# EAGLE design bicore (EAGLE 9.0.0)
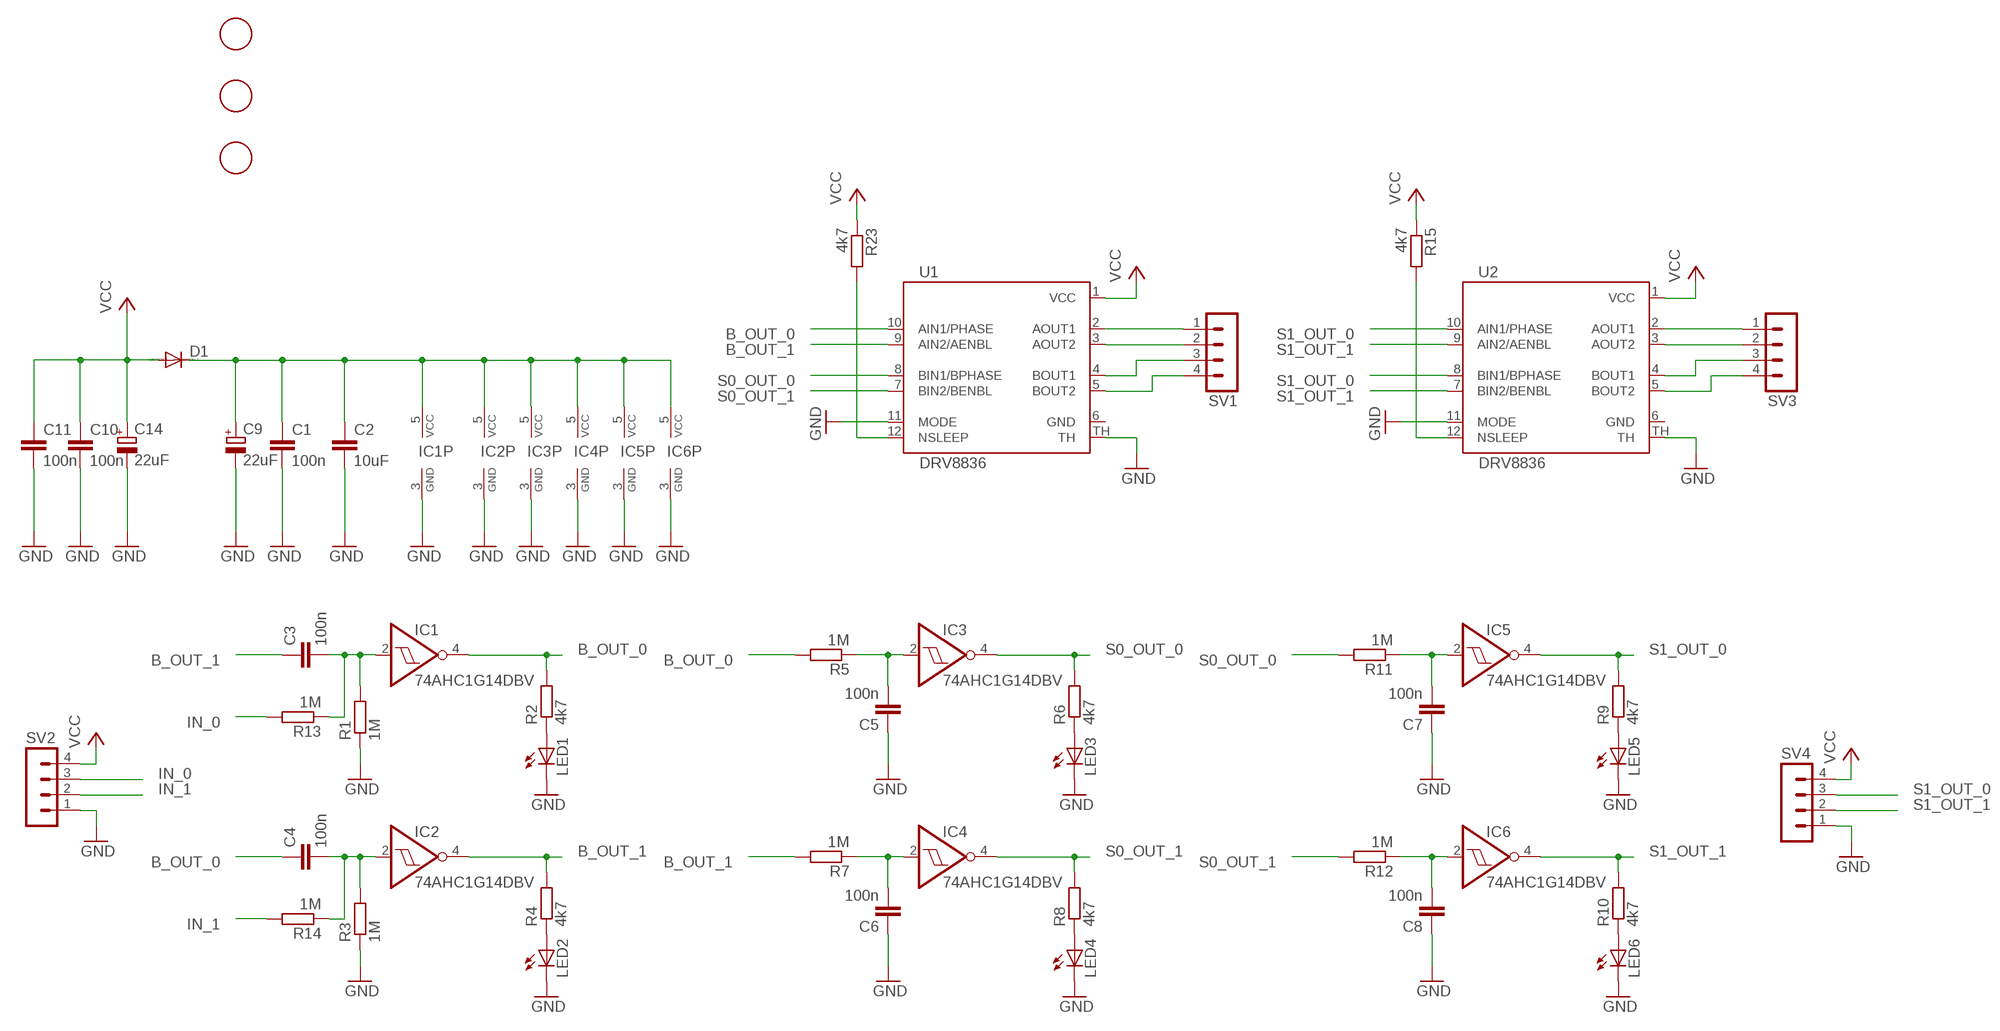
[diagram p0: schematic, sheet 1]

## Parts
C1  100n  C-EUC0805  [C0805]
C2  10uF  C-EUC0805  [C0805]
C3  100n  C-EUC0805  [C0805]
C4  100n  C-EUC0805  [C0805]
C5  100n  C-EUC0805  [C0805]
C6  100n  C-EUC0805  [C0805]
C7  100n  C-EUC0805  [C0805]
C8  100n  C-EUC0805  [C0805]
C9  22uF  CPOL-EU153CLV-0605  [153CLV-0605]
C10  100n  C-EUC0805  [C0805]
C11  100n  C-EUC0805  [C0805]
C14  22uF  CPOL-EU153CLV-0605  [153CLV-0605]
D1  DIODE-DO214AA  [DO214AA]
IC1  74AHC1G14DBV  [SOT23-5]
IC2  74AHC1G14DBV  [SOT23-5]
IC3  74AHC1G14DBV  [SOT23-5]
IC4  74AHC1G14DBV  [SOT23-5]
IC5  74AHC1G14DBV  [SOT23-5]
IC6  74AHC1G14DBV  [SOT23-5]
LED1  LEDSML1206  [SML1206]
LED2  LEDSML1206  [SML1206]
LED3  LEDSML1206  [SML1206]
LED4  LEDSML1206  [SML1206]
LED5  LEDSML1206  [SML1206]
LED6  LEDSML1206  [SML1206]
R1  1M  R-EU_M0805  [M0805]
R2  4k7  R-EU_M0805  [M0805]
R3  1M  R-EU_M0805  [M0805]
R4  4k7  R-EU_M0805  [M0805]
R5  1M  R-EU_M0805  [M0805]
R6  4k7  R-EU_M0805  [M0805]
R7  1M  R-EU_M0805  [M0805]
R8  4k7  R-EU_M0805  [M0805]
R9  4k7  R-EU_M0805  [M0805]
R10  4k7  R-EU_M0805  [M0805]
R11  1M  R-EU_M0805  [M0805]
R12  1M  R-EU_M0805  [M0805]
R13  1M  R-EU_M0805  [M0805]
R14  1M  R-EU_M0805  [M0805]
R15  4k7  R-EU_M0805  [M0805]
R23  4k7  R-EU_M0805  [M0805]
SV1  MA04-1  [MA04-1]
SV2  MA04-1  [MA04-1]
SV3  MA04-1  [MA04-1]
SV4  MA04-1  [MA04-1]
U1  DRV8836  [12WSON]
U2  DRV8836  [12WSON]
U$1  ADAFRUIT_FIDUCIAL  [ADAFRUIT_FIDUCIAL_1MM]
U$2  ADAFRUIT_FIDUCIAL  [ADAFRUIT_FIDUCIAL_1MM]
U$3  ADAFRUIT_FIDUCIAL  [ADAFRUIT_FIDUCIAL_1MM]

## Nets
B_OUT_0: C4.1 IC1.4(O) R2.2 R5.2 U1.10(AIN1/PHASE)
B_OUT_1: C3.1 IC2.4(O) R4.2 R7.2 U1.9(AIN2/AENBL)
GND: C1.2 C2.2 C5.1 C6.1 C7.1 C8.1 C9.- C10.2 C11.2 C14.- IC1.3(GND) IC2.3(GND) IC3.3(GND) IC4.3(GND) IC5.3(GND) IC6.3(GND) LED1.C LED2.C LED3.C LED4.C LED5.C LED6.C R1.1 R3.1 SV2.1 SV4.1 U1.11(MODE) U1.TH U2.11(MODE) U2.TH
IN_0: R13.2 SV2.3
IN_1: R14.2 SV2.2
N$1: C1.1 C2.1 C9.+ D1.C IC1.5(VCC) IC2.5(VCC) IC3.5(VCC) IC4.5(VCC) IC5.5(VCC) IC6.5(VCC)
N$2: C3.2 IC1.2(I) R1.2 R13.1
N$3: C5.2 IC3.2(I) R5.1
N$4: C4.2 IC2.2(I) R3.2 R14.1
N$5: LED1.A R2.1
N$6: LED3.A R6.1
N$7: LED2.A R4.1
N$8: C6.2 IC4.2(I) R7.1
N$9: LED4.A R8.1
N$10: C7.2 IC5.2(I) R11.1
N$11: LED5.A R9.1
N$12: C8.2 IC6.2(I) R12.1
N$13: LED6.A R10.1
N$14: R15.2 U2.12(NSLEEP)
N$15: SV3.4 U2.5(BOUT2)
N$16: SV3.3 U2.4(BOUT1)
N$17: SV3.2 U2.3(AOUT2)
N$18: SV3.1 U2.2(AOUT1)
N$30: SV1.4 U1.5(BOUT2)
N$31: SV1.3 U1.4(BOUT1)
N$32: R23.2 U1.12(NSLEEP)
N$33: SV1.2 U1.3(AOUT2)
N$34: SV1.1 U1.2(AOUT1)
S0_OUT_0: IC3.4(O) R6.2 R11.2 U1.8(BIN1/BPHASE)
S0_OUT_1: IC4.4(O) R8.2 R12.2 U1.7(BIN2/BENBL)
S1_OUT_0: IC5.4(O) R9.2 SV4.3 U2.8(BIN1/BPHASE) U2.10(AIN1/PHASE)
S1_OUT_1: IC6.4(O) R10.2 SV4.2 U2.7(BIN2/BENBL) U2.9(AIN2/AENBL)
VCC: C10.1 C11.1 C14.+ D1.A R15.1 R23.1 SV2.4 SV4.4 U1.1(VCC) U2.1(VCC)
Unconnected: U1.6(GND) U2.6(GND)

## Library data of the parts
C1-C8 C10 C11 = resistor:C-EU: CAPACITOR, European symbol
C9 C14 = resistor:CPOL-EU: POLARIZED CAPACITOR, European symbol
D1 = diode:DIODE-: DIODE
IC1-IC6 = 74xx-little-de:74*1G14: Single Schmitt-Trigger Inverter Gate
LED1-LED6 = led:LED: LED OSRAM: - CHIPLED LG R971, LG N971, LY N971, LG Q971, LY Q971, LO R971, LY R971 LH N974, LH R974 LS Q976, LO Q976, LY Q976 LO Q996 - Hyper CHIPLED LW Q18S LB Q993, LB Q99A, LB R99A - SideLED LS A670, LO A670, LY A670, LG A670, LP A670 LB A673, LV A673, LT A673, LW A673 LH A674 LY A675 LS A676, LA A676, LO A676, LY A676, LW A676 LS A679, LY A679, LG A679 - Hyper Micro SIDELED® LS Y876, LA Y876, LO Y876, LY Y876 LT Y87S - SmartLED LW L88C, LW L88S LB L89C, LB L89S, LG L890 LS L89K, LO L89K, LY L89K LS L896, LA L896, LO L896, LY L896 - TOPLED LS T670, LO T670, LY T670, LG T670, LP T670 LSG T670, LSP T670, LSY T670, LOP T670, LYG T670 LG T671, LOG T671, LSG T671 LB T673, LV T673, LT T673, LW T673 LH T674 LS T676, LA T676, LO T676, LY T676, LB T676, LH T676, LSB T676, LW T676 LB T67C, LV T67C, LT T67C, LS T67K, LO T67K, LY T67K, LW E67C LS E67B, LA E67B, LO E67B, LY E67B, LB E67C, LV E67C, LT E67C LW T67C LS T679, LY T679, LG T679 LS T770, LO T770, LY T770, LG T770, LP T770 LB T773, LV T773, LT T773, LW T773 LH T774 LS E675, LA E675, LY E675, LS T675 LS T776, LA T776, LO T776, LY T776, LB T776 LHGB T686 LT T68C, LB T68C - Hyper Mini TOPLED® LB M676 - Mini TOPLED Santana® LG M470 LS M47K, LO M47K, LY M47K Source: http://www.osram.convergy.de LUXEON: - LUMILED® LXK2-PW12-R00, LXK2-PW12-S00, LXK2-PW14-U00, LXK2-PW14-V00 LXK2-PM12-R00, LXK2-PM12-S00, LXK2-PM14-U00 LXK2-PE12-Q00, LXK2-PE12-R00, LXK2-PE12-S00, LXK2-PE14-T00, LXK2-PE14-U00 LXK2-PB12-K00, LXK2-PB12-L00, LXK2-PB12-M00, LXK2-PB14-N00, LXK2-PB14-P00, LXK2-PB14-Q00 LXK2-PR12-L00, LXK2-PR12-M00, LXK2-PR14-Q00, LXK2-PR14-R00 LXK2-PD12-Q00, LXK2-PD12-R00, LXK2-PD12-S00 LXK2-PH12-R00, LXK2-PH12-S00 LXK2-PL12-P00, LXK2-PL12-Q00, LXK2-PL12-R00 Source: www.luxeon.com KINGBRIGHT: KA-3528ASYC Source: www.kingbright.com
R1-R15 R23 = resistor:R-EU_: RESISTOR, European symbol
SV1-SV4 = con-lstb:MA04-1: PIN HEADER; OC_FARNELL: unknown; OC_NEWARK: unknown
U1 U2 = balto:DRV8836: Dual low voltage H-Bridge IC
U$1-U$3 = main_board:ADAFRUIT_FIDUCIAL: For use by pick and place machines to calibrate the vision/machine, 1mm By microbuilder.eu

## Board
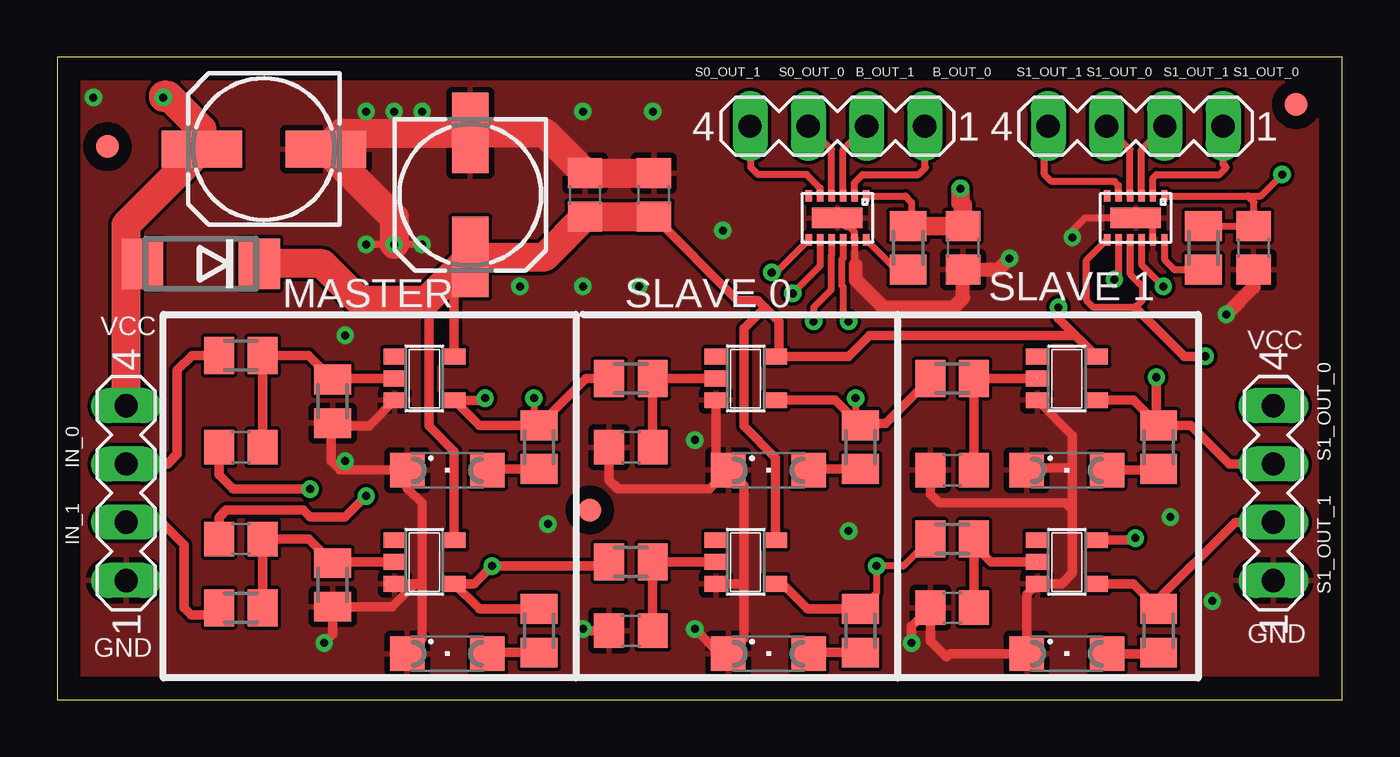
[diagram p1: board, top side]
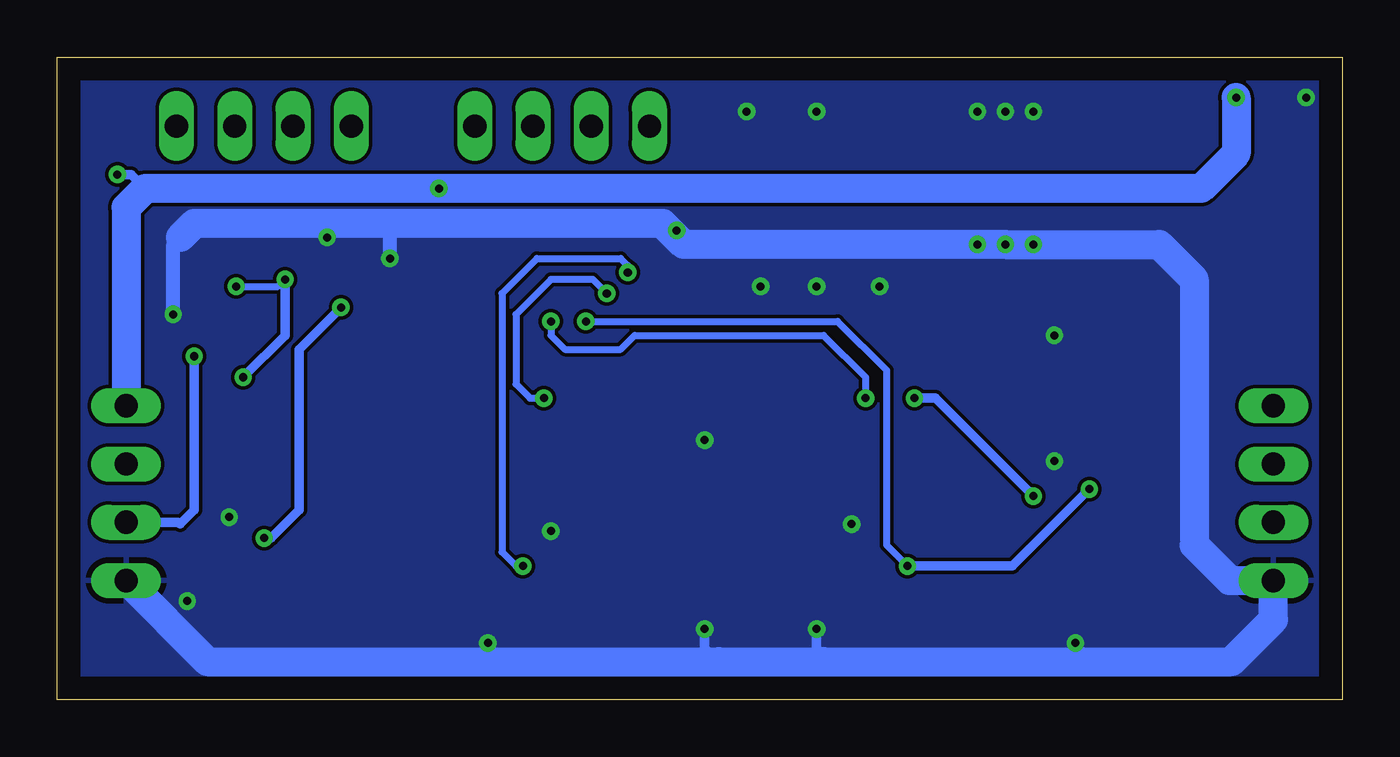
[diagram p2: board, bottom side, seen from below]

Size 56 x 28 mm. Coordinates in mm from the lower left corner, seen from the top.
Outline: 0,0 56,0 56,28 0,28 0,0
Copper layers (1*16): Top 0.035mm / dielectric 1.5mm / Bottom 0.035mm
Design rules "default": minimum track width 6mil, minimum drill 0.35mm, track to track 6mil, track to pad 6mil, pad to pad 6mil, via to via 6mil, smd to smd 6mil, copper to edge 40mil, drill to drill 6mil, minimum pad ring 10mil, minimum via ring 8mil, stop-mask expansion 4mil, vias tented up to drill 0mil, thermal gap 10mil

### Footprints (pad centres in the part's own frame; a part is rotated, then mirrored left to right if it is on the bottom)
C0805 = smd 1.3 x 1.5: 1 -0.95,0; 2 0.95,0
153CLV-0605 = smd 3.5 x 1.6: + 2.7,0; - -2.7,0
DO214AA = smd 1.8 x 2.2: A 2.55,0; C -2.55,0
SOT23-5 = smd 0.69 x 0.99: 1 -0.95,-1.29; 2 0,-1.29; 3 0.95,-1.29; 4 0.95,1.3; 5 -0.95,1.3
SML1206 = smd 1.5 x 1.5: A 1.75,0; C -1.75,0
M0805 = smd 1.3 x 1.6: 1 -0.95,0; 2 0.95,0
MA04-1 = drill 1.016 long: 1 -3.81,0; 2 -1.27,0; 3 1.27,0; 4 3.81,0
12WSON = smd 0.28 x 0.5: 1 -1.25,-0.95; 2 -0.75,-0.95; 3 -0.25,-0.95; 4 0.25,-0.95; 5 0.75,-0.95; 6 1.25,-0.95; 7 1.25,0.95; 8 0.75,0.95; 9 0.25,0.95; 10 -0.25,0.95; 11 -0.75,0.95; 12 -1.25,0.95 | smd 2.2 x 0.9: TH 0,0
ADAFRUIT_FIDUCIAL_1MM = smd 1 x 1: 1 0,0

### Placement (x,y rotation side)
C1  26,22 90 top
C2  23,22 90 top
C3  8,11 0 top
C4  8,7 0 top
C5  25,11 0 top
C6  25,3 0 top
C7  39,10 0 top
C8  39,4 0 top
C9  18,22 270 top
C10  39.48,19.7 270 top
C11  52.13,19.7 270 top
C14  9,24 180 top
D1  6.26,19 180 top
IC1  16,14 270 top
IC2  16,6 270 top
IC3  30,14 270 top
IC4  30,6 270 top
IC5  44,14 270 top
IC6  44,6 270 top
LED1  17,10 0 top
LED2  17,2 0 top
LED3  31,10 0 top
LED4  31,2 0 top
LED5  44,10 0 top
LED6  44,2 0 top
R1  12,13 90 top
R2  21,11 90 top
R3  12,5 90 top
R4  21,3 90 top
R5  25,14 180 top
R6  35,11 90 top
R7  25,6 180 top
R8  35,3 90 top
R9  48,11 90 top
R10  48,3 90 top
R11  39,14 180 top
R12  39,7 180 top
R13  8,15 180 top
R14  8,4 180 top
R15  49.95,19.7 270 top
R23  37.09,19.7 270 top
SV1  34,25 180 top
SV2  3,9 90 top
SV3  47,25 180 top
SV4  53,9 90 top
U1  34,21 180 top
U2  47,21 180 top
U$1  2.18,24.11 0 top
U$2  54,25.94 0 top
U$3  23.21,8.26 0 top

### Tracks (layer width: path | path; a pad name or v marks a point on that pad's centre or on a via)
B_OUT_0  (via drill 0.35)
  Top 0.305: U1.10 34.25,19.25 34.19,19.18 34.19,18.07 34.25,18 34.25,16.73 v34.49,16.49 | v20.77,13.14 20.77,12.53 21.18,12.13
  Top 0.406: IC1.4 17.32,13.03 | 17.32,13.03 18.4,11.95 R2.2 21.18,12.13 23.05,14 R5.2 | C4.1 7.05,7.95 7.36,8.26 10.72,8.26 11.02,7.96 12.54,7.96 v13.46,8.87 | v18.64,13.14 18.54,13.03 17.32,13.03
  Bottom 0.305: v34.49,16.49 34.49,15.88 33.88,15.27 31.44,15.27 30.83,15.88 22.6,15.88 20.77,14.05 v20.77,13.14
  Bottom 0.406: v13.46,8.87 17.73,13.14 v18.64,13.14
B_OUT_1  (via drill 0.35)
  Top 0.305: U1.9 33.75,19.39 33.73,19.37 33.73,17.86 32.97,17.1 v32.97,16.49
  Top 0.406: R4.2 18.4,3.95 IC2.4 18.17,5.05 v18.95,5.82 23.87,5.82 R7.2 | v11.02,9.18 7.67,9.18 7.05,9.79 C3.1
  Bottom 0.305: v32.97,16.49 21.99,16.49 19.86,14.36 19.86,6.74 v18.95,5.82
  Bottom 0.406: v18.95,5.82 14.37,5.82 v11.02,9.18
GND  (via drill 0.35)
  Top 0.305: 34.8,18.93 34.75,18.97 U1.11 34.75,20.37 34.52,20.6 34.4,20.6 U1.TH | v15.9,19.84 v14.68,19.84 v13.46,19.84 | U2.11 47.75,20.91 47.6,21.06 47.06,21.06 U2.TH 44.79,21 44.24,20.45 v44.24,20.15
  Top 0.406: IC1.3 13.58,11.92 12.13,11.92 R1.1 11.94,11.98 11.94,10.39 12.33,10 LED1.C 15.25,9.21 15.9,8.57 15.9,4.91 | 15.9,4.91 15.9,2.65 LED2.C | IC2.3 15.59,5.05 | 15.59,5.05 15.76,5.05 15.9,4.91 | 15.59,5.05 14.59,4.05 R3.1 12,2.84 v11.63,2.47 | C6.1 22.99,3 v22.91,3.08 | IC3.3 28.71,10.54 LED3.C | LED3.C 28.43,9.18 24.43,9.18 24.05,9.56 C5.1 | LED3.C 29.92,9.33 29.92,4.91 | 29.92,4.91 29.92,2.67 LED4.C 28.86,2 v27.79,3.08 | IC4.3 29.78,5.05 29.92,4.91 | C7.1 38.05,8.97 38.45,8.57 43.94,8.57 44.24,8.26 | 44.24,8.26 44.24,5.52 43.78,5.05 IC6.3 42.25,4.59 LED6.C 38.9,2 38.76,1.86 38.05,2.57 C8.1 37.23,3.18 v37.23,2.47 | IC5.3 44.24,11.52 44.24,10.09 | 44.24,10.09 44.24,8.26 | LED5.C 42.34,10.09 44.24,10.09
  Top 0.61: 34.8,18.93 34.8,18.32 36.01,17.1 39.06,17.1 39.48,17.51 C10.2 41.01,18.74 v41.5,19.23 | C11.2 52.13,17.98 v50.95,16.8
  Top 1.27: v14.68,19.84 14.68,21.02 C14.- 12.4,24.7 C9.- 21.25,24.7 C2.2 C1.2
  Bottom 0.305: v44.24,20.15 44.24,20.76
  Bottom 0.406: v11.63,2.47 11.63,1.96 11.33,1.65 | v22.91,3.08 22.91,1.96 22.6,1.65 | v27.79,3.08 27.79,2.26 27.18,1.65 | v37.23,2.47 37.23,1.65
  Bottom 0.61: v41.5,19.23 41.5,20.76 | v50.95,16.8 50.95,19.84 50.03,20.76
  Bottom 1.27: SV4.1 49.46,1.65 37.23,1.65 27.18,1.65 22.6,1.65 11.33,1.65 4.83,1.65 3,3.48 SV2.1 4.9,5.19 6.45,6.74 6.45,18.32 7.97,19.84 v14.68,19.84 28.7,19.84 29.61,20.76 41.5,20.76 44.24,20.76 50.03,20.76 50.65,20.15
  other vias: 50.34,4.3 34.49,7.35 21.38,7.65 22.91,18.01 20.16,18.01 25.35,18.01 1.57,26.24 12.54,15.88 12.54,10.39 27.78,11.31 25.96,25.63 22.91,25.63 48.51,7.96 14.68,25.63 15.9,25.63 13.46,25.63 29,20.45
  pour Top: -1.48,28.99 56.74,28.99 56.74,-2.41 -1.48,-2.41
  pour Bottom: -1.78,28.68 57.35,28.68 57.35,-7.59 -1.78,-7.59
IN_0
  Top 0.406: SV2.3 4.8,10.27 5.23,10.7 5.23,14.36 5.87,15 R13.2
IN_1
  Top 0.406: SV2.2 4.54,7.73 5.53,6.74 5.53,3.99 5.84,3.69 6.74,3.69 R14.2
N$1  (via drill 0.35)
  Top 0.406: IC1.5 17.3,18.6 17.83,19.13 C9.+ | IC2.5 17.3,10.82 16.2,11.92 16.2,17.31 16.11,17.41 | C1.1 29.65,17.41 30.53,17.41 30.83,17.1 | 30.83,17.1 31.44,16.49 31.44,15.09 IC3.5 34.47,14.95 35.41,15.88 44.37,15.88 IC5.5 43.63,16.62 v43.63,17.1 | IC4.5 31.3,10.54 29.92,11.92 29.92,16.19 30.83,17.1 | v46.99,7.04 46.9,6.95 IC6.5
  Top 1.27: 17.83,19.13 16.11,17.41 13.14,17.41 11.55,19 D1.C | C9.+ 21.25,19.3 C2.1 C1.1
  Bottom 0.406: v43.63,17.1 45.46,15.27 45.46,8.26 46.68,7.04 v46.99,7.04
N$2
  Top 0.406: C3.2 R13.1 10.95,15 R1.2 12.05,14 IC1.2
N$3
  Top 0.406: C5.2 R5.1 IC3.2
N$4
  Top 0.406: IC2.2 12.05,6 R3.2 10.95,7 C4.2 R14.1
N$5
  Top 0.406: R2.1 18.8,10.05 LED1.A
N$6
  Top 0.406: LED3.A 32.8,10.05 R6.1
N$7
  Top 0.406: R4.1 18.8,2.05 LED2.A
N$8
  Top 0.406: C6.2 R7.1 IC4.2
N$9
  Top 0.406: R8.1 32.8,2.05 LED4.A
N$10
  Top 0.406: IC5.2 R11.1 C7.2
N$11
  Top 0.406: LED5.A 47.95,10 R9.1
N$12
  Top 0.406: C8.2 39.95,6.74 | 39.95,6.74 R12.1 | IC6.2 40.69,6 39.95,6.74
N$13
  Top 0.406: LED6.A 47.95,2 R10.1
N$14
  Top 0.305: R15.2 48.7,18.74 48.25,19.19 U2.12
N$15
  Top 0.305: U2.5 46.25,22.41 46.07,22.59 43.33,22.59 43.02,22.89 43.02,24.84 SV3.4
N$16
  Top 0.305: U2.4 46.75,23.98 SV3.3
N$17
  Top 0.305: U2.3 47.25,23.98 SV3.2
N$18
  Top 0.305: U2.2 47.75,22.74 47.9,22.89 50.65,22.89 50.95,23.2 50.81,23.34 SV3.1
N$30
  Top 0.305: U1.5 33.25,22.3 32.66,22.89 30.53,22.89 30.22,23.2 30.22,24.97 SV1.4
N$31
  Top 0.305: U1.4 33.75,23.98 SV1.3
N$32
  Top 0.305: R23.2 36.55,18.74 U1.12
N$33
  Top 0.305: U1.3 34.25,23.98 SV1.2
N$34
  Top 0.305: U1.2 34.75,22.54 35.1,22.89 37.54,22.89 37.84,23.2 37.81,23.23 SV1.1
S0_OUT_0  (via drill 0.35)
  Top 0.305: U1.8 33.25,18.91 v32.05,17.71 | v34.8,13.14 34.8,12.16 34.91,12.04
  Top 0.406: IC3.4 33.9,13.05 34.91,12.04 | 34.91,12.04 R6.2 | R11.2 36.09,12.04 34.91,12.04
  Bottom 0.305: v32.05,17.71 32.66,18.32 34.49,18.32 36.01,16.8 36.01,13.75 35.41,13.14 v34.8,13.14
S0_OUT_1  (via drill 0.35)
  Top 0.305: 32.54,19.84 U1.7 31.32,18.62 v31.14,18.62 | R8.2 35.71,4.66 v35.71,5.82 36.87,5.82 R12.2
  Top 0.406: IC4.4 31.6,5.05 32.7,3.95 R8.2
  Bottom 0.305: v35.71,5.82 36.01,5.82 36.62,6.43 36.62,17.71 35.1,19.23 31.44,19.23 31.14,18.93 v31.14,18.62
S1_OUT_0  (via drill 0.35)
  Top 0.305: U2.8 46.25,18.5 v46.07,18.32 | U2.10 47.25,18.97 v48.21,18.01
  Top 0.406: IC5.4 46.9,13.05 47.81,12.14 | 47.81,12.14 R9.2 49.39,11.95 51.07,10.27 SV4.3 | v47.9,14.05 47.9,12.22 47.81,12.14
  Bottom 0.305: v48.21,18.01 46.38,18.01 v46.07,18.32
  Bottom 0.406: v46.07,18.32 46.07,15.88 v47.9,14.05
S1_OUT_1  (via drill 0.35)
  Top 0.305: U2.9 46.75,18.56 47.29,18.01 47.29,17.41 46.99,17.1 45.16,17.1 44.85,17.41 44.85,19.15 U2.7
  Top 0.406: IC6.4 46.9,5.05 47.78,4.17 | 47.78,4.17 R10.2 | SV4.2 51.33,7.73 47.78,4.17 | 46.99,17.1 49.12,14.97 v50.03,14.97
  Bottom 0.406: v50.03,14.97 50.03,8.26 50.65,7.65 50.72,7.73 SV4.2
VCC  (via drill 0.35)
  Top 0.305: U1.1 36.96,21.95 37.23,21.67 37.23,20.79 R23.1 | U2.1 51.89,21.95 | 51.89,21.95 52.17,21.67 52.13,21.64 C11.1 R15.1 | 51.89,21.95 52.45,21.95 v53.39,22.89
  Top 0.813: R23.1 C10.1 39.48,21.56 39.37,21.67 v39.37,22.28
  Top 1.27: SV2.4 3,19.23 | 3,19.23 3,20.7 C14.+ 6.3,24.87 4.82,26.35 4.62,26.35 v4.62,26.24 | D1.A 3.23,19 3,19.23
  Bottom 0.406: v53.39,22.89 52.78,22.89 52.17,22.28
  Bottom 1.27: v4.62,26.24 4.62,23.81 6.14,22.28 v39.37,22.28 52.17,22.28 53,21.45 SV4.4

### Text on the board
tNames: S0_OUT_1 | S0_OUT_0 | B_OUT_1 | B_OUT_0 | S1_OUT_1 | S1_OUT_0 | S1_OUT_1 | S1_OUT_0 | MASTER | SLAVE 0 | SLAVE 1 | VCC | VCC | IN_0 | S1_OUT_0 | IN_1 | S1_OUT_1 | GND | GND